# Altium schematic sheet 3_AUDIO.schdoc
size 312 x 225 mm; SheetNumber: 3; SheetTotal: 3
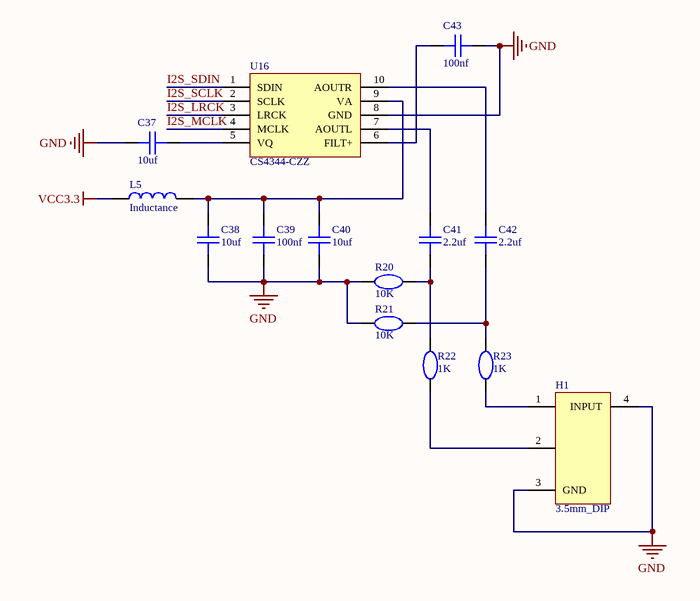
[diagram p0: 3_AUDIO.schdoc]

## Parts
C37  10uf  [3216]
C38  10uf  [3216]
C39  100nf  [3216]
C40  10uf  [3216]
C41  2.2uf  [0805]
C42  2.2uf  [0805]
C43  100nf  [3216]
H1  3.5mm_DIP  [PJ320D]
L5  Inductance  [0805]
R20  10K  [0402R]
R21  10K  [0402R]
R22  1K  [0402R]
R23  1K  [0402R]
U16  CS4344-CZZ  [TSSOP-10_L3.0-W3.0-P0.50-LS4.9-BL]

## Nets
GND: C37.2 C38.2 C39.2 C40.2 C43.2 H1.3(GND) H1.4(INPUT) R20.2 R21.2 U16.8(GND)
VCC3.3: L5.1
I2S_LRCK: U16.3(LRCK)
I2S_MCLK: U16.4(MCLK)
I2S_SCLK: U16.2(SCLK)
I2S_SDIN: U16.1(SDIN)
NetC37_1: C37.1 U16.5(VQ)
NetC38_1: C38.1 C39.1 C40.1 L5.2 U16.9(VA)
NetC41_1: C41.1 U16.7(AOUTL)
NetC41_2: C41.2 R20.1 R22.1
NetC42_1: C42.1 U16.10(AOUTR)
NetC42_2: C42.2 R21.1 R23.1
NetC43_1: C43.1 U16.6(FILT+)
NetH1_1: H1.1 R23.2
NetH1_2: H1.2 R22.2

## Library data of the parts
C37-C43 = CAP: Symbol: 0.1u; Add into BOM: yes; Origin Footprint: C0805; Device: 0.1u; Convert to PCB: yes
H1 = 3.5mm_DIP: Add into BOM: yes; Symbol: 3.5mm_DIP; Device: 3.5mm_DIP; Convert to PCB: yes; Origin Footprint: PJ320D
L5 = Inductance: Symbol: 1m; Add into BOM: yes; Origin Footprint: L1608; Device: 1m; Convert to PCB: yes
R20-R23 = RST: Symbol: 0_; Add into BOM: yes; Origin Footprint: R0805; Device: 0_; Convert to PCB: yes
U16 = CS4344-CZZ: Add into BOM: yes; Symbol: CS4344-CZZ; Device: CS4344-CZZ; Convert to PCB: yes; Origin Footprint: TSSOP-10_L3.0-W3.0-P0.50-LS4.9-BL